# EAGLE design proto4-left (EAGLE 9.7.0)
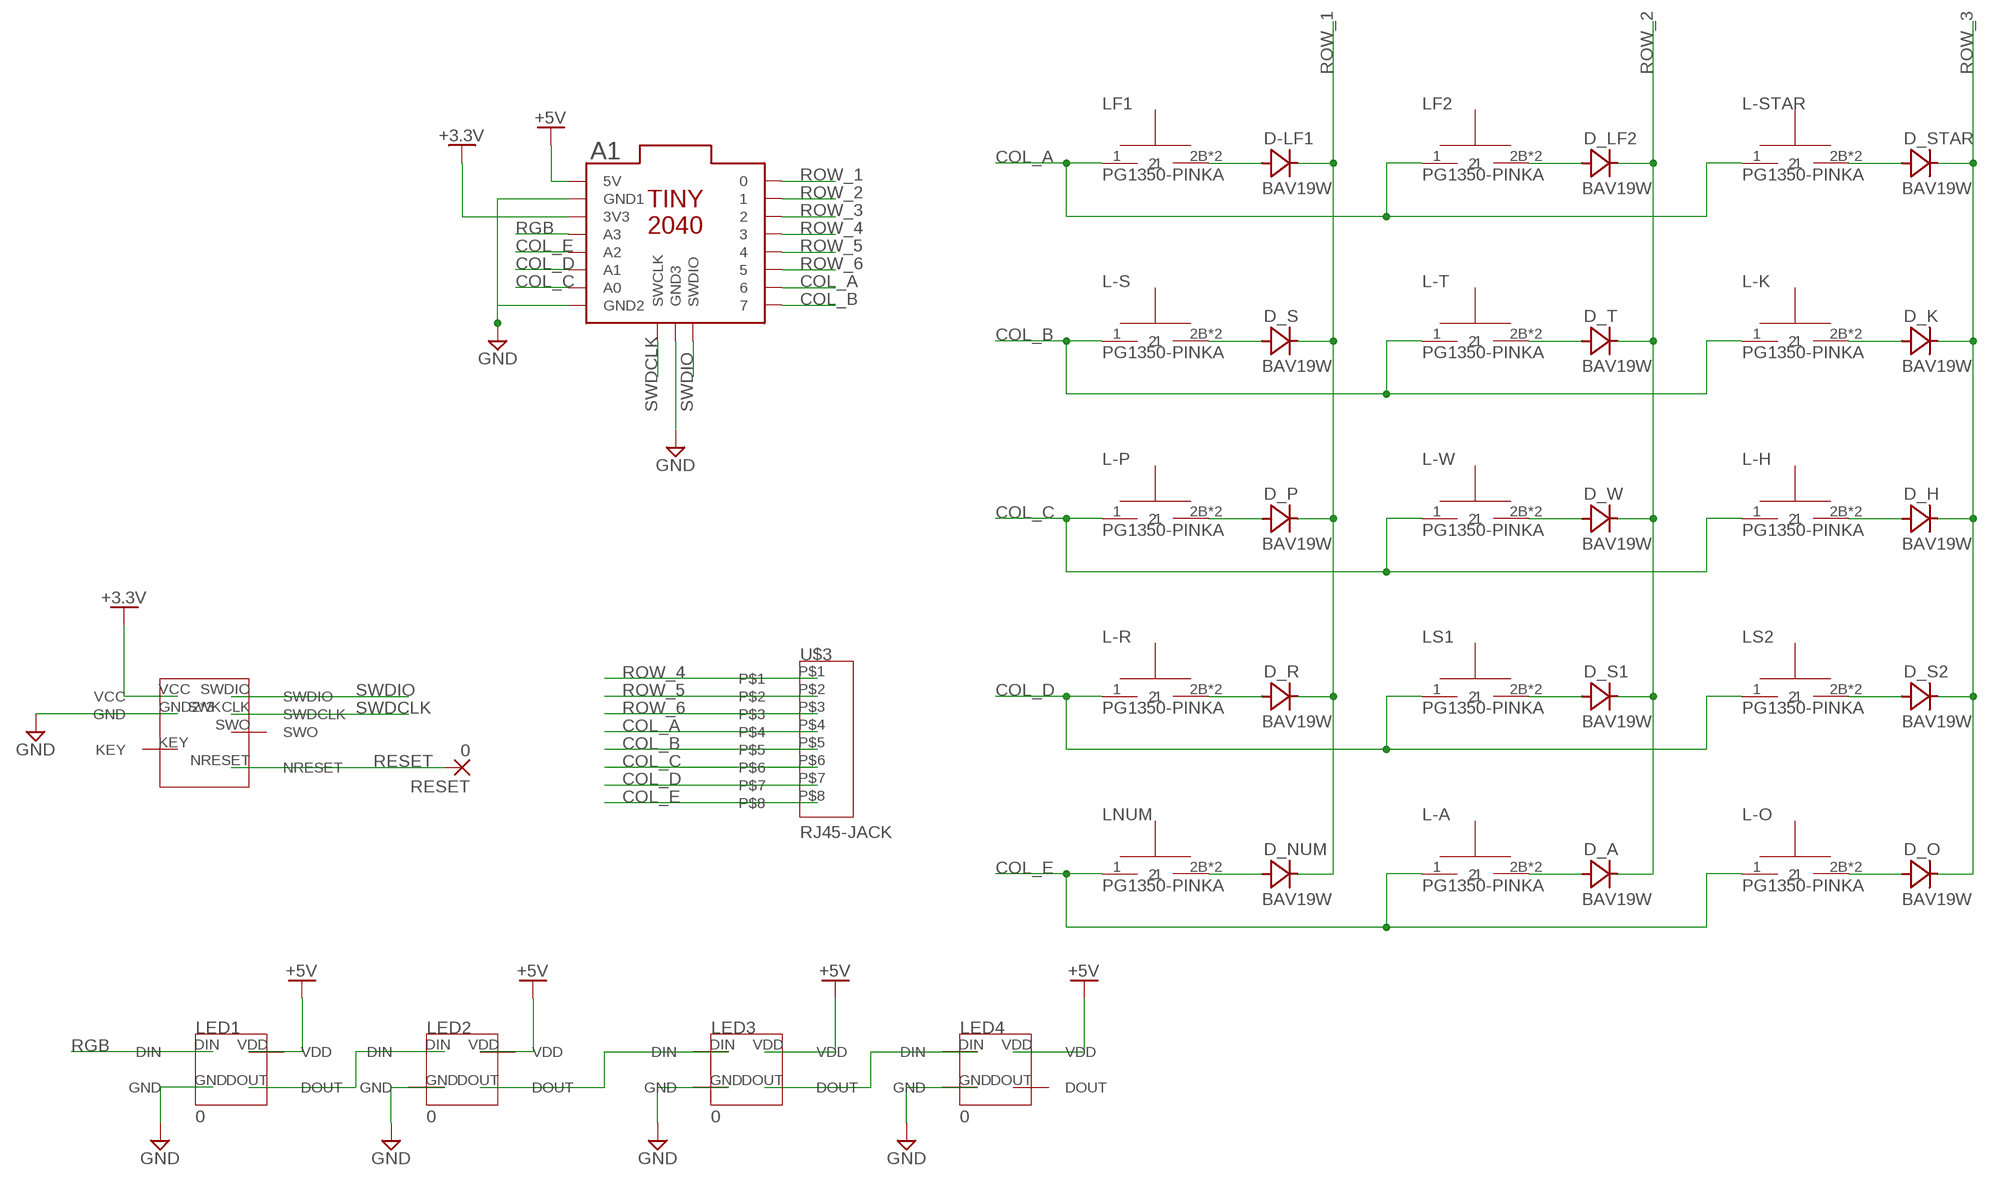
[diagram p0: schematic, sheet 1]

## Parts
A1  TINY2040  [TINY2040]
D-LF1  BAV19W  [SOD123]
D_A  BAV19W  [SOD123]
D_H  BAV19W  [SOD123]
D_K  BAV19W  [SOD123]
D_LF2  BAV19W  [SOD123]
D_NUM  BAV19W  [SOD123]
D_O  BAV19W  [SOD123]
D_P  BAV19W  [SOD123]
D_R  BAV19W  [SOD123]
D_S  BAV19W  [SOD123]
D_S1  BAV19W  [SOD123]
D_S2  BAV19W  [SOD123]
D_STAR  BAV19W  [SOD123]
D_T  BAV19W  [SOD123]
D_W  BAV19W  [SOD123]
L-A  PG1350-PINKA  [PG1350]
L-H  PG1350-PINKA  [PG1350]
L-K  PG1350-PINKA  [PG1350]
L-O  PG1350-PINKA  [PG1350]
L-P  PG1350-PINKA  [PG1350]
L-R  PG1350-PINKA  [PG1350]
L-S  PG1350-PINKA  [PG1350]
L-STAR  PG1350-PINKA  [PG1350]
L-T  PG1350-PINKA  [PG1350]
L-W  PG1350-PINKA  [PG1350]
LED1  0  SK6812-3535  [SK6812-MINI-HS]
LED2  0  SK6812-3535  [SK6812-MINI-HS]
LED3  0  SK6812-3535  [SK6812-MINI-HS]
LED4  0  SK6812-3535  [SK6812-MINI-HS]
LF1  PG1350-PINKA  [PG1350]
LF2  PG1350-PINKA  [PG1350]
LNUM  PG1350-PINKA  [PG1350]
LS1  PG1350-PINKA  [PG1350]
LS2  PG1350-PINKA  [PG1350]
RESET  0  SMD2  [SMD1,27-2,54]
U$2  CORTEX-M0  [CORTEX-M10]
U$3  RJ45-JACK  [C-BMJ-0051-RJ45]

## Nets
+3.3V: A1.3V3 U$2.VCC
+5V: A1.5V LED1.VDD LED2.VDD LED3.VDD LED4.VDD
COL_A: A1.6 L-STAR.1 LF1.1 LF2.1 U$3.P$4
COL_B: A1.7 L-K.1 L-S.1 L-T.1 U$3.P$5
COL_C: A1.A0 L-H.1 L-P.1 L-W.1 U$3.P$6
COL_D: A1.A1 L-R.1 LS1.1 LS2.1 U$3.P$7
COL_E: A1.A2 L-A.1 L-O.1 LNUM.1 U$3.P$8
GND: A1.GND1 A1.GND2 A1.GND3 LED1.GND LED2.GND LED3.GND LED4.GND U$2.GND2(GND) U$2.GND3(GND) U$2.GNDDETECT(GND)
N$1: D-LF1.A LF1.2B LF1.2T
N$2: D_LF2.A LF2.2B LF2.2T
N$3: D_STAR.A L-STAR.2B L-STAR.2T
N$4: D_S.A L-S.2B L-S.2T
N$5: D_T.A L-T.2B L-T.2T
N$6: D_K.A L-K.2B L-K.2T
N$7: D_P.A L-P.2B L-P.2T
N$8: D_W.A L-W.2B L-W.2T
N$9: D_H.A L-H.2B L-H.2T
N$10: D_R.A L-R.2B L-R.2T
N$11: D_S1.A LS1.2B LS1.2T
N$12: D_S2.A LS2.2B LS2.2T
N$13: D_NUM.A LNUM.2B LNUM.2T
N$14: D_A.A L-A.2B L-A.2T
N$15: D_O.A L-O.2B L-O.2T
N$16: LED3.DOUT LED4.DIN
N$19: LED2.DOUT LED3.DIN
N$20: LED1.DOUT LED2.DIN
RESET: RESET.1(P) U$2.NRESET
RGB: A1.A3 LED1.DIN
ROW_1: A1.0 D-LF1.C D_NUM.C D_P.C D_R.C D_S.C
ROW_2: A1.1 D_A.C D_LF2.C D_S1.C D_T.C D_W.C
ROW_3: A1.2 D_H.C D_K.C D_O.C D_S2.C D_STAR.C
ROW_4: A1.3 U$3.P$1
ROW_5: A1.4 U$3.P$2
ROW_6: A1.5 U$3.P$3
SWDCLK: A1.SWCLK U$2.SWKCLK(SWDCLK)
SWDIO: A1.SWDIO U$2.SWDIO
Unconnected: LED4.DOUT U$2.KEY U$2.SWO

## Library data of the parts
A1 = pimoroni-boards:TINY2040
D-LF1 D_A D_H D_K D_LF2 D_NUM D_O D_P D_R D_S D_S1 D_S2 D_STAR D_T D_W = Keyboard Parts:BAV19W
L-A L-H L-K L-O L-P L-R L-S L-STAR L-T L-W LF1 LF2 LNUM LS1 LS2 = Keyboard Parts:PG1350-PINK
LED1-LED4 = Keyboard Parts:SK6812-3535
RESET = wirepad:SMD2: SMD PAD
U$2 = Keyboard Parts:CORTEX-M0
U$3 = Keyboard Parts:RJ45-JACK

## Board
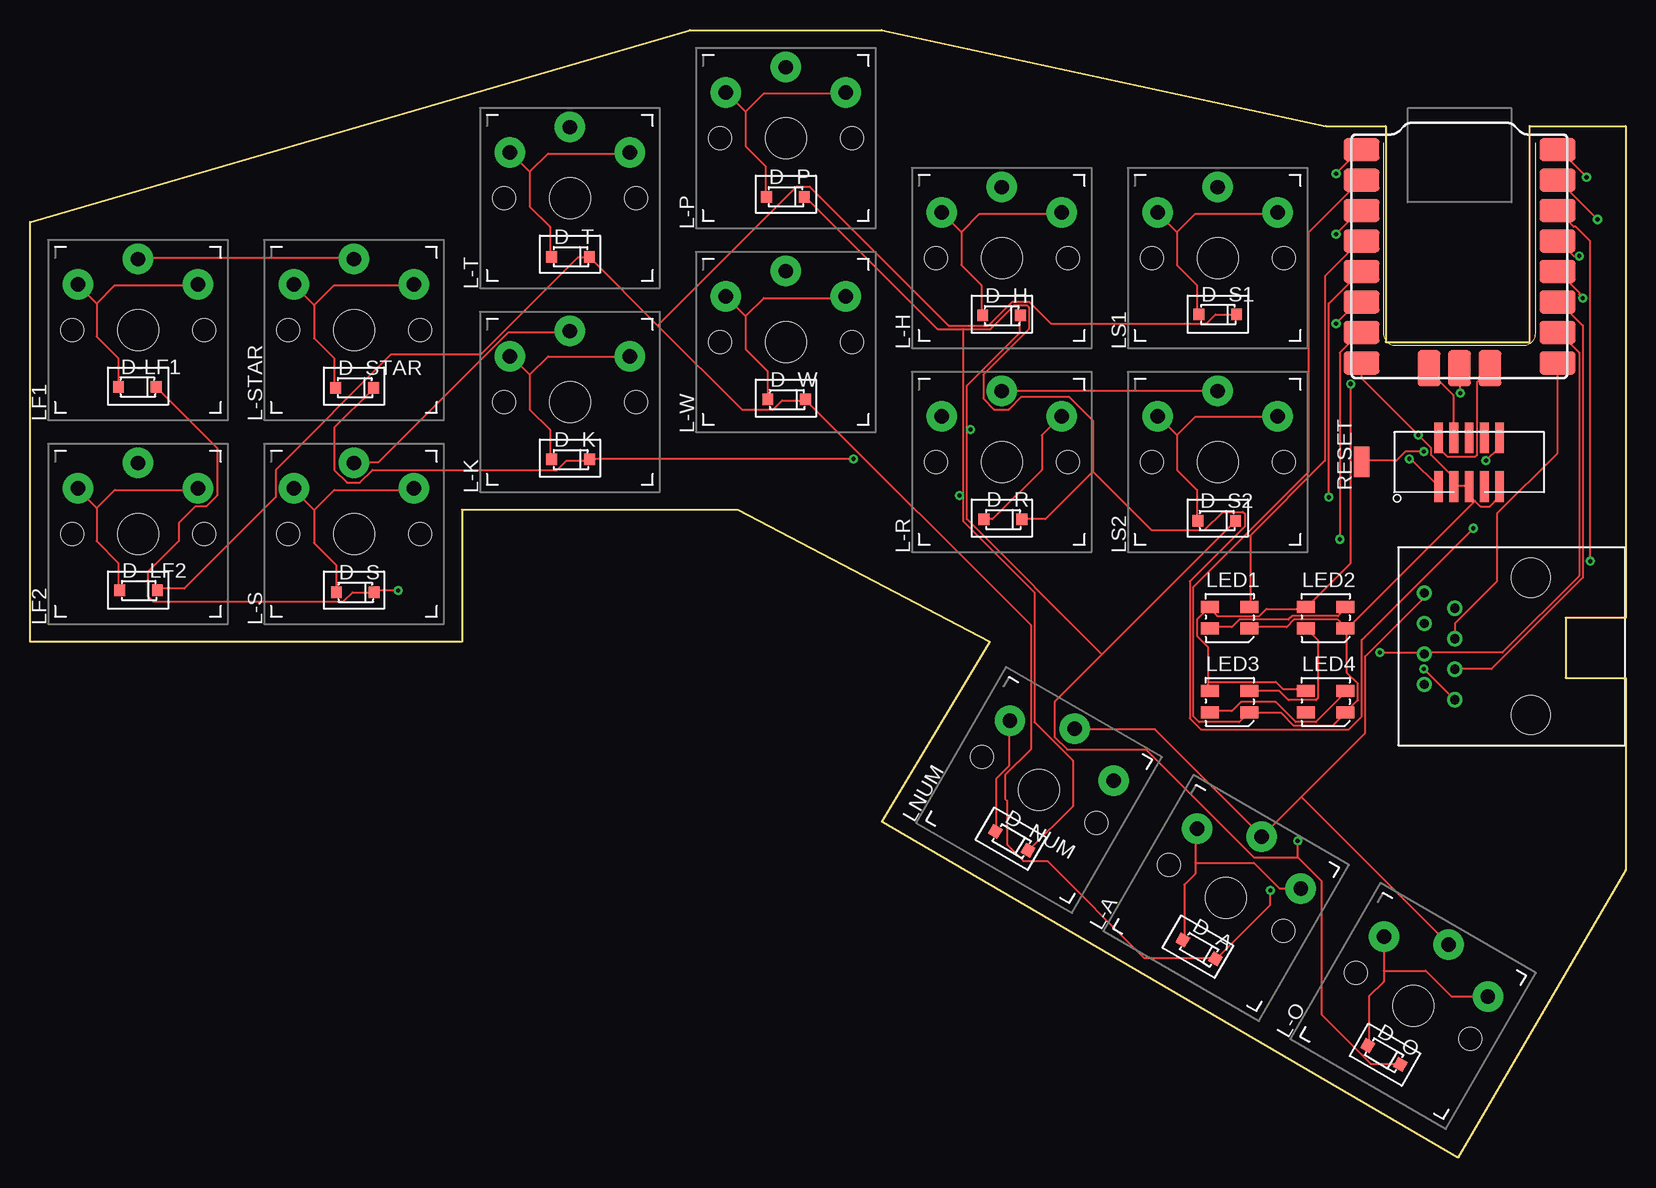
[diagram p1: board, top side]
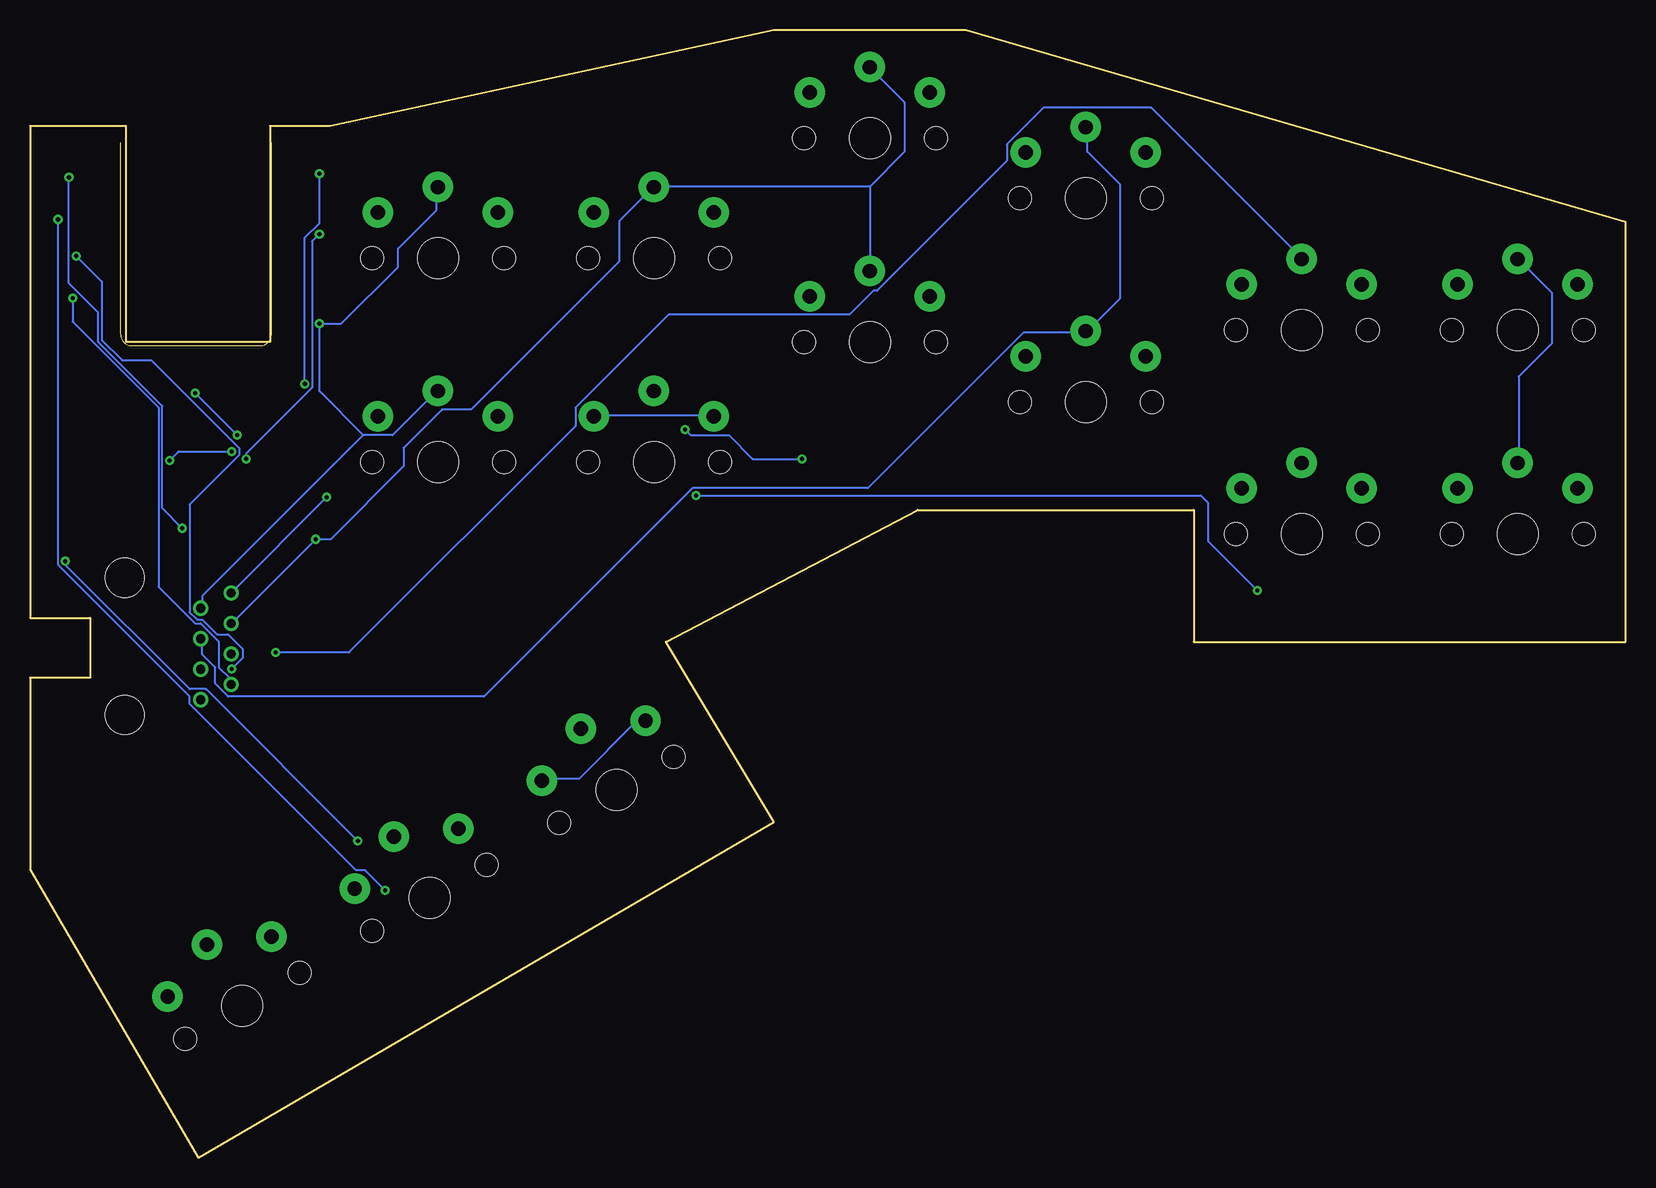
[diagram p2: board, bottom side, seen from below]

Size 133 x 94 mm. Coordinates in mm from the lower left corner, seen from the top.
Outline: 0,78 55,94 71,94 108,86 113,86 113,68 125,68 125,86 133,86 133,45 128,45 128,40 133,40 133,24 119,0 71,28 80,43 59,54 36,54 36,43 0,43 0,78
Copper layers (1*16): Top 0.035mm / dielectric 1.5mm / Bottom 0.035mm
Design rules "Fusion Electronics Design Rules": minimum track width 6mil, minimum drill 0.35mm, track to track 6mil, track to pad 6mil, pad to pad 6mil, via to via 6mil, smd to smd 6mil, copper to edge 40mil, drill to drill 6mil, minimum pad ring 10mil, minimum via ring 8mil, stop-mask expansion 4mil, vias tented up to drill 0mil, thermal gap 10mil

### Footprints (pad centres in the part's own frame; a part is rotated, then mirrored left to right if it is on the bottom)
TINY2040 = smd 1.9 x 3: 0 1.27,8.17; 1 3.81,8.17; 2 6.35,8.17; 3 8.89,8.17; 3V3 6.35,-8.17; 4 11.43,8.17; 5 13.97,8.17; 5V 1.27,-8.17; 6 16.51,8.17; 7 19.05,8.17; A0 16.51,-8.17; A1 13.97,-8.17; A2 11.43,-8.17; A3 8.89,-8.17; GND1 3.81,-8.17; GND2 19.05,-8.17 | smd 3 x 1.9: GND3 19.49,0; SWCLK 19.49,-2.54; SWDIO 19.49,2.54
SOD123 = smd 0.9 x 0.95: A -1.575,0; C 1.575,0
PG1350 = drill 1.2 pad 2.54: 1 5.9,0; 2B 3.8,5; 2T 3.8,-5 | hole 3.4: 0,0 | hole 1.9: 0,5.5; 0,-5.5
SK6812-MINI-HS = smd 1.5 x 1: DIN 1.65,0.9; DOUT -1.65,-0.9; GND 1.65,-0.9; VDD -1.65,0.9
SMD1,27-2,54 = smd 1.27 x 2.54: 1 0,0
CORTEX-M10 = smd 2.55 x 0.74: GND2 -2.025,0; GND3 -2.025,1.27; GNDDETECT -2.025,-2.54; KEY -2.025,-1.27; NC 2.025,-1.27; NRESET 2.025,-2.54; SWDIO 2.025,2.54; SWKCLK 2.025,1.27; SWO 2.025,0; VCC -2.025,2.54
C-BMJ-0051-RJ45 = drill 0.76: P$1 -3.81,0; P$2 -2.54,2.54; P$3 -1.27,0; P$4 0,2.54; P$5 1.27,0; P$6 2.54,2.54; P$7 3.81,0; P$8 5.08,2.54 | hole 3.25: -5.08,-6.35; 6.35,-6.35

### Placement (x,y rotation side)
A1  119.16,85.29 270 top
D-LF1  8.95,64.25 0 top
D_A  97.46,17.35 330 top
D_H  80.99,70.2 0 top
D_K  45.06,58.2 0 top
D_LF2  9.05,47.28 0 top
D_NUM  81.83,26.4 330 top
D_O  112.87,8.55 330 top
D_P  62.97,80.1 0 top
D_R  81.1,53.2 0 top
D_S  27.12,47.13 0 top
D_S1  99.01,70.3 0 top
D_S2  98.92,53.1 0 top
D_STAR  27.06,64.18 0 top
D_T  45.05,75.1 0 top
D_W  63.08,63.2 0 top
L-A  99.71,21.63 60 top
L-H  81,75 90 top
L-K  45,63 90 top
L-O  115.29,12.63 60 top
L-P  63,85 90 top
L-R  81,58 90 top
L-S  27,52 90 top
L-STAR  27,69 90 top
L-T  45,80 90 top
L-W  63,68 90 top
LED1  100,45 0 top
LED2  108,45 0 top
LED3  100,38 0 top
LED4  108,38 0 top
LF1  9,69 90 top
LF2  9,52 90 top
LNUM  84.12,30.63 60 top
LS1  99,75 90 top
LS2  99,58 90 top
RESET  111,58 0 top
U$2  119.96,57.96 90 top
U$3  118.76,41.98 90 top

### Tracks (layer width: path | path; a pad name or v marks a point on that pad's centre or on a via)
+3.3V  (via drill 0.35)
  Top 0.152: v114.97,58.25 115.12,58.25 117.41,55.96 U$2.VCC | v108.87,76.99 110.85,78.97 A1.3V3
  Bottom 0.152: v114.97,58.25 114.97,58.7 109.48,64.19 109.48,76.38 v108.87,76.99
+5V  (via drill 0.35)
  Top 0.152: 98.2,39.65 98.2,42.55 97.29,43.46 97.29,44.84 98.2,45.75 LED1.VDD 98.36,45.75 98.97,45.14 102.47,45.14 103.08,45.75 106.28,45.75 LED2.VDD 106.43,45.9 110.09,49.56 v110.09,64.5 | 98.2,39.65 98.2,39.04 LED3.VDD | 98.2,39.65 103.84,39.65 104.45,39.04 106.28,39.04 LED4.VDD | v108.87,82.02 110.85,84 A1.5V
  Bottom 0.152: v108.87,82.02 108.87,77.91 110.09,76.69 v110.09,64.5
COL_A  (via drill 0.35)
  Top 0.152: A1.6 127.47,68.76 129.14,67.09 129.14,48.49 122.74,42.09 116.34,42.09 U$3.P$4 116.19,42.09 v112.53,42.09 | L-STAR.1 26.88,75.01 9.05,75.01 LF1.1
  Bottom 0.152: LF2.1 8.9,57.94 8.9,65.1 6.16,67.85 6.16,72.11 8.9,74.86 LF1.1 | v112.53,42.09 106.43,42.09 87.54,60.99 87.54,62.51 79.76,70.29 64.68,70.29 62.7,72.27 62.39,72.27 51.57,83.09 51.57,84.46 48.52,87.51 39.53,87.51 27.03,75.01 L-STAR.1
COL_B
  Top 0.152: U$3.P$5 118.78,43.31 118.78,44.53 122.28,48.04 122.28,53.67 127.31,58.7 127.31,66.17 A1.7 | L-S.1 27.03,57.94 29.02,57.94 39.84,68.76 44.86,68.76 L-K.1
  Bottom 0.152: L-T.1 44.86,85.83 44.86,83.85 42.12,81.11 42.12,71.66 44.86,68.91 L-K.1 45.02,68.76 50.2,68.76 63.15,55.81 77.78,55.81 95.16,38.43 116.49,38.43 117.56,39.5 117.56,40.87 118.63,41.94 118.63,43.16 U$3.P$5
COL_C  (via drill 0.35)
  Top 0.152: v109.18,51.54 109.18,67.09 110.85,68.76 A1.A0
  Bottom 0.152: U$3.P$6 116.19,44.53 v109.18,51.54 107.96,51.54 101.86,57.64 101.86,59.16 98.66,62.36 96.22,62.36 83.88,74.71 83.88,78.06 81.14,80.8 L-H.1 80.98,80.95 63,80.95 | 63,80.95 L-W.1 | 63,80.95 60.1,83.85 60.1,87.96 63,90.86 L-P.1
COL_D  (via drill 0.35)
  Top 0.152: v108.87,69.52 110.55,71.2 110.85,71.2 A1.A1 | L-R.1 81.14,63.88 98.97,63.88 LS2.1
  Bottom 0.152: 105.22,60.23 118.63,46.82 118.63,45.9 U$3.P$7 | 105.22,60.23 102.78,60.23 99.12,63.88 LS2.1 | 105.22,60.23 108.87,63.88 v108.87,69.52 107.04,69.52 102.32,74.25 102.32,75.77 99.12,78.97 99.12,80.8 LS1.1
COL_E  (via drill 0.35)
  Top 0.152: 105.98,30.05 102.78,26.85 L-A.1 102.62,26.85 93.78,35.69 87.08,35.69 LNUM.1 | 105.98,30.05 111.31,35.39 111.31,41.79 116.19,46.66 116.19,46.97 U$3.P$8 | v108.26,55.05 108.26,71.2 110.85,73.79 A1.A2 | 105.98,30.05 118.17,17.86 L-O.1
  Bottom 0.152: v108.26,55.05 116.19,47.12 U$3.P$8
GND  (via drill 0.35)
  Top 0.152: 120.45,54.74 120,55.2 120,55.81 U$2.GND2 119.84,55.96 118.78,55.96 U$2.GND3 118.63,55.96 118.63,56.72 116.8,58.55 116.8,59.16 v115.73,60.23 111.01,64.95 111.01,66.17 A1.GND2 | 120.45,54.74 120.91,54.28 121.67,54.28 122.44,55.05 122.44,55.81 U$2.GNDDETECT | v119.24,63.73 119.24,65.71 A1.GND3 | LED1.GND 101.71,44.23 104.76,44.23 105.37,44.84 109.03,44.84 109.63,44.23 LED2.GND 109.79,44.07 | A1.GND1 110.85,81.41 106.59,77.14 106.59,57.18 96.98,47.58 96.98,36.76 97.44,36.3 100.8,36.3 101.56,37.06 LED3.GND 101.71,37.06 104.3,37.06 105.37,36 108.57,36 109.63,37.06 LED4.GND 109.79,37.22 110.7,38.13 110.7,39.5 109.79,40.42 109.79,44.07 | 109.79,44.07 120.45,54.74
  Bottom 0.152: v115.73,60.23 v119.24,63.73
N$1
  Top 0.152: 5.55,71.2 5.55,68.46 7.37,66.63 7.37,64.34 D-LF1.A | 5.55,71.2 4.02,72.72 LF1.2B | 5.55,71.2 7.07,72.72 13.93,72.72 LF1.2T
N$2
  Top 0.152: 5.55,54.13 5.55,51.39 7.37,49.56 7.37,47.43 D_LF2.A | 5.55,54.13 4.02,55.66 LF2.2B | 5.55,54.13 7.07,55.66 13.93,55.66 LF2.2T
N$3
  Top 0.152: 23.68,71.05 23.68,68.31 25.36,66.63 25.36,64.19 D_STAR.A | 23.68,71.05 22,72.72 L-STAR.2B | 23.68,71.05 25.36,72.72 31.91,72.72 L-STAR.2T
N$4
  Top 0.152: 23.68,53.98 23.68,51.24 25.51,49.41 25.51,47.27 D_S.A | 23.68,53.98 22,55.66 L-S.2B | 23.68,53.98 25.36,55.66 31.91,55.66 L-S.2T
N$5
  Top 0.152: 41.66,82.17 41.66,79.28 43.34,77.6 43.34,75.16 D_T.A | 41.66,82.17 40.14,83.7 L-T.2B | 41.66,82.17 43.19,83.7 49.89,83.7 L-T.2T
N$6
  Top 0.152: 41.66,65.26 41.66,62.36 43.34,60.69 43.34,58.25 D_K.A | 41.66,65.26 40.14,66.78 L-K.2B | 41.66,65.26 43.19,66.78 49.89,66.78 L-K.2T
N$7
  Top 0.152: 59.65,87.2 59.65,84.31 61.32,82.63 61.32,80.19 D_P.A | 59.65,87.2 58.12,88.73 L-P.2B | 59.65,87.2 61.17,88.73 67.88,88.73 L-P.2T
N$8
  Top 0.152: 59.65,70.13 59.65,67.39 61.48,65.56 61.48,63.28 D_W.A | 59.65,70.13 58.12,71.66 L-W.2B | 59.65,70.13 61.17,71.66 67.88,71.66 L-W.2T
N$9
  Top 0.152: 77.63,77.14 77.63,74.4 79.31,72.72 79.31,70.29 D_H.A | 77.63,77.14 76.11,78.67 L-H.2B | 77.63,77.14 79.15,78.67 85.86,78.67 L-H.2T
N$10
  Top 0.152: D_R.A 79.61,53.22 80.22,53.22 84.34,57.33 84.34,60.23 85.86,61.75 L-R.2T
  Bottom 0.152: L-R.2B 76.11,61.9 85.86,61.9 L-R.2T
N$11
  Top 0.152: 95.61,77.14 95.61,74.4 97.29,72.72 97.29,70.44 D_S1.A | 95.61,77.14 94.09,78.67 LS1.2B | 95.61,77.14 97.14,78.67 104,78.67 LS1.2T
N$12
  Top 0.152: 95.61,60.23 95.61,57.33 97.29,55.66 97.29,53.22 D_S2.A | 95.61,60.23 94.09,61.75 LS2.2B | 95.61,60.23 97.14,61.75 104,61.75 LS2.2T
N$13
  Top 0.152: D_NUM.A 80.53,27.31 80.53,31.58 81.59,32.64 81.59,36.3 LNUM.2B
  Bottom 0.152: LNUM.2T 90.28,31.58 87.23,31.58 82.51,36.3 81.75,36.3 LNUM.2B
N$14
  Top 0.152: 97.14,24.57 97.14,27.31 L-A.2B | 97.14,24.57 97.14,23.65 96.22,22.74 96.22,18.16 D_A.A | 97.14,24.57 102.01,24.57 104.15,22.43 105.82,22.43 L-A.2T
N$15
  Top 0.152: 112.84,15.57 112.84,18.32 L-O.2B | 112.84,15.57 112.84,14.66 111.62,13.44 111.62,9.48 D_O.A | 112.84,15.57 116.34,15.57 118.47,13.44 121.52,13.44 L-O.2T
N$16
  Top 0.152: LED3.DOUT 98.36,37.22 100.19,37.22 100.95,37.98 103.84,37.98 105.52,36.3 107.2,36.3 109.79,38.89 LED4.DIN
N$19
  Top 0.152: LED3.DIN 101.71,38.89 104.15,38.89 104.91,38.13 107.2,38.13 107.35,38.28 107.35,43.16 106.43,44.07 LED2.DOUT
N$20
  Top 0.152: LED1.DOUT 98.36,44.23 100.19,44.23 100.8,44.84 104.91,44.84 105.22,45.14 109.03,45.14 109.63,45.75 LED2.DIN
RESET  (via drill 0.35)
  Top 0.152: v116.19,58.86 114.66,58.86 113.9,58.09 111.01,58.09 RESET.1 | v121.37,58.09 122.44,59.16 122.44,59.92 U$2.NRESET
  Bottom 0.152: v116.19,58.86 120.61,58.86 v121.37,58.09
RGB
  Top 0.152: LED1.DIN 101.71,45.9 101.71,51.85 107.96,58.09 107.96,73.49 110.85,76.38 A1.A3
ROW_1  (via drill 0.35)
  Top 0.152: D-LF1.C 10.57,64.19 15.6,59.16 15.6,55.2 14.69,54.28 13.77,54.28 12.4,52.91 12.4,51.39 9.81,48.8 9.81,46.82 10.27,46.36 26.12,46.36 26.88,47.12 28.56,47.12 D_S.C 28.71,47.27 v30.69,47.27 | 88.6,57.18 84.64,53.22 82.81,53.22 D_R.C | 88.6,57.18 88.6,61.45 86.62,63.43 82.66,63.43 81.59,62.36 80.37,62.36 79.46,63.28 79.46,65.26 83.27,69.07 83.27,70.9 83.12,71.05 82.05,71.05 80.07,69.07 77.78,69.07 | 77.78,69.07 75.65,69.07 64.68,80.04 D_P.C | 77.78,69.07 77.78,55.2 | 77.78,55.2 77.78,53.06 83.73,47.12 83.73,36.3 86.93,33.1 86.93,29.29 83.27,25.63 D_NUM.C | v129.75,81.72 127.47,84 A1.0 | v120.3,52.45 111.01,43.16 111.01,36.76 109.94,35.69 97.59,35.69 96.68,36.61 96.68,48.04 101.25,52.61 101.25,53.67 101.1,53.83 99.42,53.83 97.9,52.3 93.48,52.3 88.6,57.18 | 77.78,55.2 v77.48,55.2
  Bottom 0.152: v129.75,81.72 129.75,72.88 127.31,70.44 127.31,68 121.98,62.67 121.98,54.13 v120.3,52.45 | v30.69,47.27 34.81,51.39 34.81,54.59 35.42,55.2 v77.48,55.2
ROW_2  (via drill 0.35)
  Top 0.152: D_LF2.C 10.73,47.43 12.86,47.43 20.48,55.05 20.48,57.33 30.08,66.93 37.55,66.93 45.63,75.01 46.54,75.01 D_T.C 46.69,75.01 52.33,69.37 | 52.33,69.37 59.34,62.36 61.93,62.36 62.7,63.12 64.52,63.12 D_W.C 64.68,63.12 83.42,44.38 83.42,34.02 81.29,31.88 81.29,29.9 81.44,29.75 81.44,26.09 82.81,24.72 84.79,24.72 92.87,16.64 98.81,16.64 D_A.C 98.97,16.64 103.39,21.06 v103.39,22.28 | 52.33,69.37 63.91,80.95 64.98,80.95 76.56,69.37 79.92,69.37 81.9,71.35 83.27,71.35 85.1,69.52 98.05,69.52 98.81,70.29 100.49,70.29 D_S1.C | v130.67,78.21 127.47,81.41 A1.1
  Bottom 0.152: v130.67,78.21 130.67,49.41 119.69,38.43 119.69,37.83 105.82,23.96 105.06,23.96 v103.39,22.28
ROW_3  (via drill 0.35)
  Top 0.152: D_STAR.C 28.56,64.04 25.36,60.84 25.36,57.33 26.42,56.27 27.49,56.27 28.56,57.33 43.95,57.33 44.71,58.09 46.54,58.09 D_K.C 46.69,58.25 v68.64,58.25 | 105.67,25.02 107.65,23.04 107.65,11.92 111.77,7.8 114.21,7.8 D_O.C | 105.67,25.02 102.01,25.02 93.02,34.02 86.47,34.02 85.4,35.08 85.4,37.98 89.36,41.94 | 89.36,41.94 100.49,53.06 D_S2.C | 78.09,60.69 78.09,53.22 89.36,41.94 | 78.09,60.69 78.09,64.34 82.51,68.76 82.51,70.13 D_H.C | v130.06,49.71 130.06,76.38 128.84,77.6 128.68,77.6 127.47,78.82 A1.2 | 105.67,25.02 v105.67,26.4 | 78.09,60.69 v78.39,60.69
  Bottom 0.152: v130.06,49.71 130.06,49.41 119.69,39.04 118.32,39.04 v105.67,26.4 | v68.64,58.25 72.75,58.25 74.73,60.23 77.94,60.23 v78.39,60.69
ROW_4  (via drill 0.35)
  Top 0.152: v116.19,40.72 118.63,38.28 U$3.P$1 | v129.14,75.16 128.68,75.16 127.47,76.38 A1.3
  Bottom 0.152: v116.19,40.72 115.27,41.64 115.27,42.4 116.49,43.62 117.41,43.62 118.63,44.84 119.08,44.84 119.69,45.45 119.69,54.44 115.58,58.55 115.58,59.16 122.89,66.48 125.33,66.48 127.01,68.15 127.01,73.03 v129.14,75.16
ROW_5  (via drill 0.35)
  Top 0.152: v129.45,71.66 129.14,71.96 129.14,72.11 127.47,73.79 A1.4
  Bottom 0.152: v129.45,71.66 129.45,69.68 122.28,62.51 122.28,47.58 119.24,44.53 118.78,44.53 117.25,43.01 117.25,40.87 116.34,39.96 116.34,39.5 U$3.P$2
ROW_6
  Top 0.152: U$3.P$3 118.78,40.72 121.83,40.72 129.45,48.34 129.45,69.37 127.47,71.35 A1.5
SWDCLK
  Top 0.152: U$2.SWKCLK 118.63,60.08 118.63,63.58 116.49,65.71 A1.SWCLK
SWDIO
  Top 0.152: U$2.SWDIO 117.56,59.92 117.56,59.01 118.17,58.4 120.45,58.4 120.61,58.55 120.61,64.65 121.67,65.71 A1.SWDIO